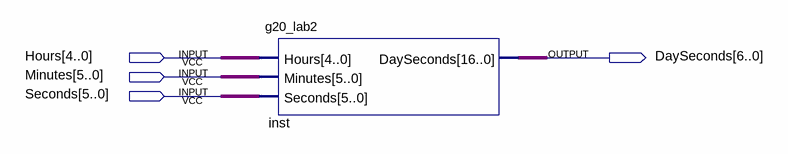
[diagram p0: schematic sheet]
// Quartus schematic Block4.bdf as structural Verilog: 1 symbols, 4 pins
module Block4 (
  input  [4:0] Hours,
  input  [5:0] Minutes,
  input  [5:0] Seconds,
  output [6:0] DaySeconds
);

  g20_lab2 inst (.Hours(Hours), .Minutes(Minutes), .Seconds(Seconds), .DaySeconds(DaySeconds));
endmodule
